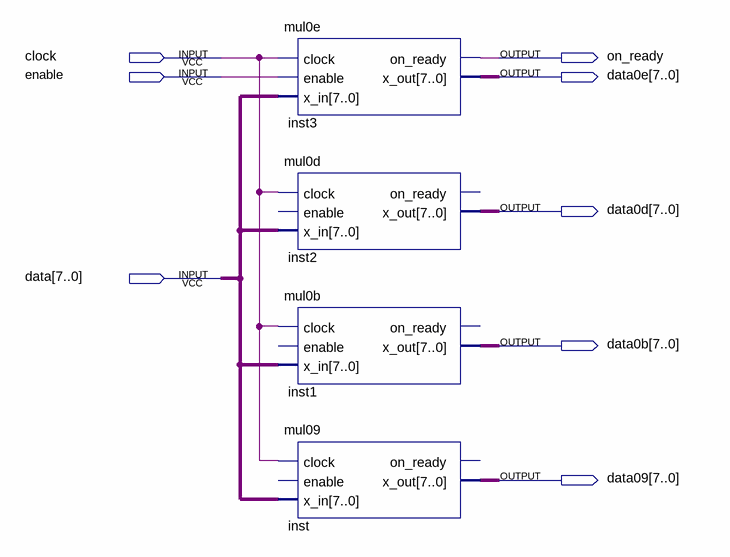
[diagram p0: schematic sheet]
// Quartus schematic mul090b0d0e.bdf as structural Verilog: 4 symbols, 8 pins
module mul090b0d0e (
  input  clock,
  input  enable,
  input  [7:0] data,
  output on_ready,
  output [7:0] data0e,
  output [7:0] data0d,
  output [7:0] data0b,
  output [7:0] data09
);

  mul0e inst3 (.clock(clock), .enable(enable), .x_in(data), .on_ready(on_ready), .x_out(data0e));
  mul0d inst2 (.clock(clock), .x_in(data), .x_out(data0d));  // open: enable, on_ready
  mul0b inst1 (.clock(clock), .x_in(data), .x_out(data0b));  // open: enable, on_ready
  mul09 inst (.clock(clock), .x_in(data), .x_out(data09));  // open: enable, on_ready
endmodule
